# EAGLE design ESPF (EAGLE 9.6.2)
Assembly variants: Terminated, Inline
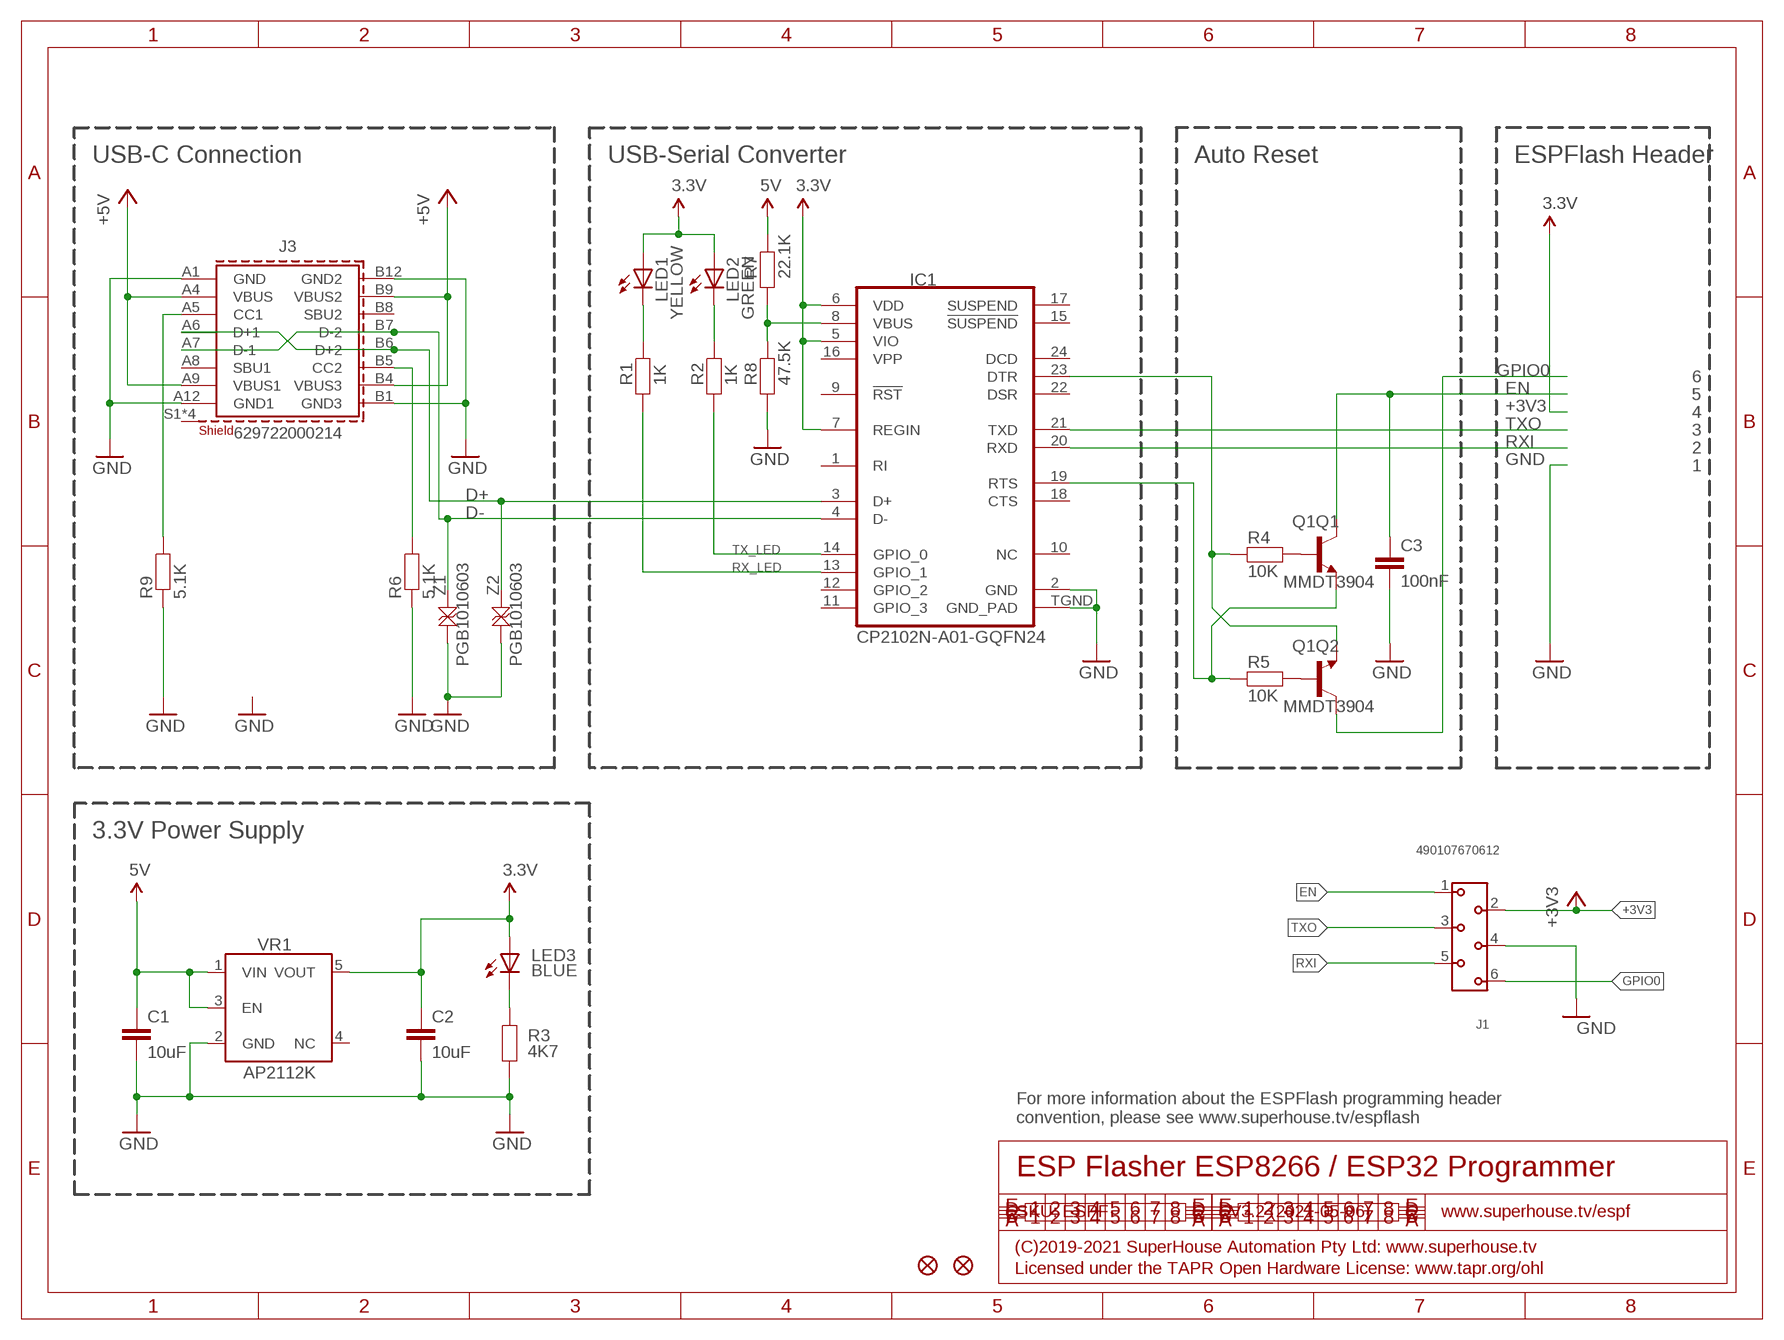
[diagram p0: schematic, sheet 1]

## Parts
C1  10uF  CAP0603  [C0603]
C2  10uF  CAP0603  [C0603]
C3  100nF  CAP0603  [C0603]
FID1  FIDUCIAL1X2.5  [FIDUCIAL-1X2.5]
FID2  FIDUCIAL1X2.5  [FIDUCIAL-1X2.5]
IC1  CP2102N-A01-GQFN24  CP2104  [QFN-24]
J1  490107670612  490107670612_DEBUGGING  [490107670612_DEBUGGING]  (not fitted in variant Terminated)  (not fitted in variant Inline)
J3  629722000214  [629722000214]
LED1  YELLOW  LED0603  [LED-0603]
LED2  GREEN  LED0603  [LED-0603]
LED3  BLUE  LED0603  [LED-0603]
Q1  MMDT3904  TRANS_NPN_DUAL-MMDT3904  [SOT-363]
R1  1K  RESISTOR0603  [R0603]
R2  1K  RESISTOR0603  [R0603]
R3  4K7  RESISTOR0603  [R0603]
R4  10K  RESISTOR0603  [R0603]
R5  10K  RESISTOR0603  [R0603]
R6  5.1K  RESISTOR0603  [R0603]
R7  22.1K  RESISTOR0603  [R0603]
R8  47.5K  RESISTOR0603  [R0603]
R9  5.1K  RESISTOR0603  [R0603]
VR1  AP2112K-3.3  AP2112KSOT25  [SOT23-5]
Z1  PGB1010603  TVS0603  [TVS0603]
Z2  PGB1010603  TVS0603  [TVS0603]

## Nets
+3V3 [Versorgung]: C2.1 IC1.5(VIO) IC1.6(VDD) IC1.7(REGIN) J1.2 LED1.A LED2.A LED3.A VR1.5(VOUT) ; supply symbol labelled 3.3V
+5V: C1.1 J3.A4(VBUS) J3.A9(VBUS1) J3.B4(VBUS3) J3.B9(VBUS2) R7.2 VR1.1(VIN) VR1.3(EN) ; supply symbol labelled 5V
D+: IC1.3(D+) J3.A6(D+1) J3.B6(D+2) Z2.2
D-: IC1.4(D-) J3.A7(D-1) J3.B7(D-2) Z1.2
DTR: IC1.23(DTR) Q1.1(Q2:E) R4.1
EN: C3.1 J1.1 Q1.3(Q1:C)
GND: C1.2 C2.2 C3.2 IC1.2(GND) IC1.TGND(GND_PAD) J1.4 J3.A1(GND) J3.A12(GND1) J3.B1(GND3) J3.B12(GND2) R3.1 R6.1 R8.1 R9.1 VR1.2(GND) Z1.1 Z2.1
GPIO0: J1.6 Q1.6(Q2:C)
N$3: LED1.C R1.2
N$4: LED2.C R2.2
N$5: LED3.C R3.2
N$6: IC1.8(VBUS) R7.1 R8.2
N$7: Q1.5(Q1:B) R4.2
N$8: Q1.2(Q2:B) R5.2
N$9: J3.B5(CC2) R6.2
N$10: J3.A5(CC1) R9.2
RTS: IC1.19(RTS) Q1.4(Q1:E) R5.1
RX_LED: IC1.13(GPIO_1) R1.1
RXI: IC1.20(RXD) J1.5
TX_LED: IC1.14(GPIO_0) R2.1
TXO: IC1.21(TXD) J1.3
Unconnected: IC1.1(RI) IC1.9(!RST) IC1.10(NC) IC1.11(GPIO_3) IC1.12(GPIO_2) IC1.15(!SUSPEND) IC1.16(VPP) IC1.17(SUSPEND) IC1.18(CTS) IC1.22(DSR) IC1.24(DCD) J3.A8(SBU1) J3.B8(SBU2) J3.S1(SHIELD) J3.S2(SHIELD) J3.S3(SHIELD) J3.S4(SHIELD) VR1.4(NC)

## Notes on the sheet
- USB-C Connection | USB-Serial Converter | Auto Reset | ESPFlash Header
- 6
- 5
- 4
- 3
- 2
- 1
- 3.3V Power Supply
- For more information about the ESPFlash programming header
  convention, please see www.superhouse.tv/espflash
- ESP Flasher ESP8266 / ESP32 Programmer
- SKU: ESPF | V3.2 (2021-05-06) | www.superhouse.tv/espf
- (C)2019-2021 SuperHouse Automation Pty Ltd: www.superhouse.tv
- Licensed under the TAPR Open Hardware License: www.tapr.org/ohl

## Library data of the parts
C1-C3 = SuperHouse-DiscreteSemi:CAP: Capacitor Standard ceramic capacitor
FID1 FID2 = SuperHouse-Symbols:FIDUCIAL: Fiducial Alignment Points Various fiducial points for machine vision alignment.
IC1 = SuperHouse-ICs:CP2104: CP2104 / CP2102N-A01-GQFN24 CP2104 USB to serial converter. The CP2104 is not recommended for new designs: replace with CP2102N-A01-GQFN24.
J1 = Wurth_Connectors_WR-WST:490107670612_DEBUGGING: WR-WST REDFIT IDC SKEDD Only use for debugging or programming application. For mechanical stressed application please use the PCB layout for permanent application PACKAGING PROPERTIES Packaging Tube ELECTRICAL PROPERTIES IR1 1 A RISO 1000 MΩ Withstanding Voltage 500 V (AC) Contact Resistance 10 mΩ PROPERTIES Insulator Material LCP Insulator Flammability Rating UL94 V-0 Insulator Color Black Contact Material CuNiSi Contact Plating Au (SKEDD), Sn (IDC) Pitch 2.54 mm Cable AWG 28/1.27 mm ribbon cable Operating Temperature -25 up to +105 °C Compliance Lead free / RoHS <https://katalog.we-online.com/media/images/v2/o104848v209%20Single_WR-WST_REDFIT.jpg> Details see: https://katalog.we-online.com/en/em/REDFIT_IDC_SKEDD Updated By Ella Wu 2019-05-21 2019 (C) Wurth Elektronik; CONTACT-RESISTANCE: 10mOhm; DATASHEET-URL: https://katalog.we-online.com/em/datasheet/490107670612.pdf; GENDER: Transition; IR: 1A; L: 15.21mm; PACKAGING: Tube; PART-NUMBER: 490107670612; PINS: 6; PITCH: 2.54mm; TOL-R: max.; USE-WITH: WR-CAB 1.27 mm Ribbon Flat Cable/WR-CAB 1.27 mm Ribbon Flat Cable 1 m pieces; WE-NUMBER: 490107670612; WORKING-VOLTAGE: 100V(AC)
J3 = Wurth_Connectors_WR-USB:629722000214: WR-COM USB 2.0 Type C Plug Vertical SMT Kind Properties Durability 10 000 Mating cycles Gender Receptacle Type Horizontal General Information Operating Temperature -40 up to +85 °C Electrical Properties Working Voltage 20 V (DC) Withstanding Voltage 100 V (AC) Contact Resistance 40 mΩ Material Properties Insulator Material LCP Insulator Flammability Rating UL94 V-0 Insulator Color Black Contact Material Brass Contact Plating Gold over Nickel Contact Type Stamped Shielding Material Steel Shielding Plating Nickel (Ni) <https://www.we-online.com/catalog/media/o689297v209%20family-wr-com-629722000214.jpg> Details see: www.we-online.com/catalog/WR-COM_USB_20_TYPE_C_RECEPTACLE_HORIZONTAL_SMT <www.we-online.com/catalog/WR-COM_USB_20_TYPE_C_RECEPTACLE_HORIZONTAL_SMT/?utm_source=eagle_model&utm_medium=description_link&utm_campaign=eisos_eagle> Updated by Ella Wu 2022-11-15 2022 (C) Würth Elektronik; APPLICATION: USB 2.0; DATASHEET-URL: https://www.we-online.com/redexpert/spec/629722000214?ae; GERDER: Receptacle; INTERFACE-TYPE: Type C; IR: 5A; MOUNT: SMT; PACKAGING: Tape and Reel; PART-NUMBER: 629722000214; PINS: 16; TYPE: Horizontal; WORKING-VOLTAGE: 20V(AC)
LED1-LED3 = SuperHouse-LEDs:LED: LEDs Standard schematic elements and footprints for 5mm, 3mm, 1206, and 0603 sized LEDs. 5mm - Spark Fun Electronics SKU : COM-00529 (and others)
Q1 = SuperHouse-DiscreteSemi:TRANS_NPN_DUAL: MMDT3904 Dual 3904 NPN transistors. Datasheet <http://www.onsemi.com/pub_link/Collateral/MBT3904DW1T1-D.PDF>; PROD_ID: TRANS-13337
R1-R9 = SuperHouse-DiscreteSemi:RESISTOR: Resistor Standard resistors.
VR1 = SuperHouse-Regulators:AP2112K: AP2112K LDO linear voltage regulator
Z1 Z2 = SuperHouse-DiscreteSemi:TVS: TVS voltage protection Zener

## Net classes
0 default: width 0.152 mm, drill 0.241 mm, clearance 0.152 mm
1 Versorgung: width 0.2 mm, drill 0.02 mm, clearance 0.032 mm

## Board
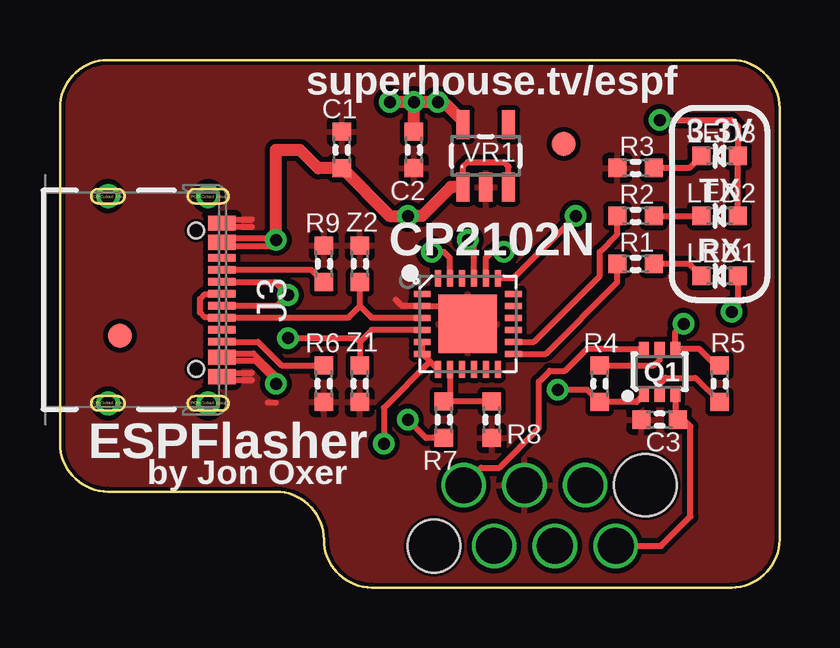
[diagram p1: board, top side]
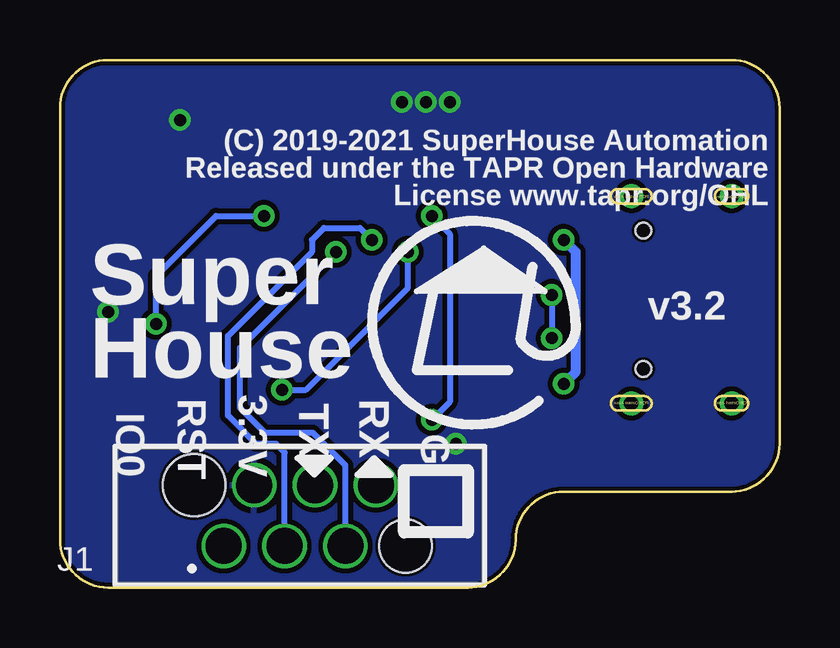
[diagram p2: board, bottom side, seen from below]

Size 30 x 22 mm. Coordinates in mm from the lower left corner, seen from the top.
Outline: 30,2 30,20 arc90 28,22 2,22 arc90 0,20 0,6 arc90 2,4 9,4 arc-90 11,2 arc90 13,0 28,0 arc90 30,2
Copper layers (1*16): Top 0.035mm / dielectric 1.5mm / Bottom 0.035mm
Design rules "SuperHouse-Design-Rules *": minimum track width 9mil, minimum drill 0.3mm, track to track 8mil, track to pad 8mil, pad to pad 7mil, via to via 8mil, smd to smd 6mil, copper to edge 6mil, drill to drill 8mil, minimum pad ring 7mil, minimum via ring 8mil, stop-mask expansion 4mil, vias tented up to drill 0.5mm, thermal gap 10mil

### Footprints (pad centres in the part's own frame; a part is rotated, then mirrored left to right if it is on the bottom)
C0603 = smd 0.762 x 0.762: 1 -0.762,0; 2 0.762,0
FIDUCIAL-1X2.5 = smd 1 x 1: 1 0,0
QFN-24 = smd 0.25 x 0.7: 1 -1.25,-1.9; 2 -0.75,-1.9; 3 -0.25,-1.9; 4 0.25,-1.9; 5 0.75,-1.9; 6 1.25,-1.9; 13 1.25,1.9; 14 0.75,1.9; 15 0.25,1.9; 16 -0.25,1.9; 17 -0.75,1.9; 18 -1.25,1.9 | smd 0.7 x 0.25: 7 1.9,-1.25; 8 1.9,-0.75; 9 1.9,-0.25; 10 1.9,0.25; 11 1.9,0.75; 12 1.9,1.25; 19 -1.9,1.25; 20 -1.9,0.75; 21 -1.9,0.25; 22 -1.9,-0.25; 23 -1.9,-0.75; 24 -1.9,-1.25 | smd 2.45 x 2.45: TGND 0,0
490107670612_DEBUGGING = drill 1.5 pad 1.825: 1 3.175,1.27; 2 1.905,-1.27; 3 0.635,1.27; 4 -0.635,-1.27; 5 -1.905,1.27; 6 -3.175,-1.27 | hole 2.2: -4.405,1.27 | hole 2.6: 4.405,-1.27
629722000214 = smd 0.3 x 1.15: A1 -3.35,4.745; A4 -2.55,4.745; A5 -1.25,4.745; A6 -0.25,4.745; A7 0.25,4.745; A8 1.25,4.745; A9 2.55,4.745; A12 3.35,4.745; B1 3.05,4.745; B4 2.25,4.745; B5 1.75,4.745; B6 0.75,4.745; B7 -0.75,4.745; B8 -1.75,4.745; B9 -2.25,4.745; B12 -3.05,4.745 | drill 0.6 pad 1: S1 -4.32,4.18; S2 4.32,4.18; S3 -4.32,0; S4 4.32,0 | hole 0.65: -2.89,3.68; 2.89,3.68
LED-0603 = smd 0.762 x 0.762: A -0.762,0; C 0.762,0
SOT-363 = smd 0.42 x 0.6: 1 -0.65,-0.95; 2 0,-0.95; 3 0.65,-0.95; 4 0.65,0.95; 5 0,0.95; 6 -0.65,0.95
R0603 = smd 0.762 x 0.762: 1 -0.762,0; 2 0.762,0
SOT23-5 = smd 0.55 x 1.2: 1 -0.95,-1.3; 2 0,-1.3; 3 0.95,-1.3; 4 0.95,1.3; 5 -0.95,1.3
TVS0603 = smd 0.762 x 0.762: 1 -0.762,0; 2 0.762,0

### Placement (x,y rotation side)
C1  11.75,18.25 90 top
C2  14.75,18.25 270 top
C3  25,7 180 top
FID1  2.5,10.5 0 top
FID2  21,18.5 0 top
IC1  17,11 270 top
J1  20,3 180 bottom
J3  2,12 270 top
LED1  27.5,13 180 top
LED2  27.5,15.5 180 top
LED3  27.5,18 180 top
Q1  25,9 0 top
R1  24,13.5 0 top
R2  24,15.5 0 top
R3  24,17.5 0 top
R4  22.5,8.5 90 top
R5  27.5,8.5 270 top
R6  11,8.5 90 top
R7  16,7 270 top
R8  18,7 90 top
R9  11,13.5 270 top
VR1  17.75,18 0 top
Z1  12.5,8.5 90 top
Z2  12.5,13.5 270 top

### Tracks (layer width: path | path; a pad name or v marks a point on that pad's centre or on a via)
+3V3  (via drill 0.5)
  Top 0.254: LED1.A 28.26,11.76 v28,11.5 | IC1.5 IC1.6 15.43,9.43 | 15.43,9.43 IC1.7 | LED2.A LED3.A 28.26,19.24 28,19.5 v25,19.5 | 15.43,9.43 13.5,7.5 v13.5,6
  Top 0.508: v14.75,20.25 v13.75,20.25 | v14.75,20.25 v15.75,20.25 16,20.25 16.8,19.45 VR1.5 | C2.1 v14.75,20.25
  pour Bottom: 0,20 arc-90 2,22 28,22 arc-90 30,20 30,2 arc-90 28,0 13,0 arc-90 11,2 arc90 9,4 2,4 arc-90 0,6
+5V  (via drill 0.5)
  Top 0.254: J3.B4 6.76,9.77 8.06,9.77 9,8.83 v9,8.5 9,8.6 8.15,9.45 J3.A9 | J3.A4 6.76,14.56 9,14.56 v9,14.5 9,14.25 J3.B9 | VR1.3 18.7,17.55 18.5,17.75 17,17.75 16.8,17.55 VR1.1 | R7.2 15.26,6.24 v14.5,7
  Top 0.508: VR1.1 16.3,16.7 15.1,15.5 v14.5,15.5 13.74,15.5 C1.1 10.76,17.49 10,18.25 9,18.25 v9,14.5
  Bottom 0.254: v14.5,15.5 13.75,14.75 13.75,7.75 v14.5,7
  Bottom 0.406: v9,8.5 8.5,9 8.5,14 v9,14.5
D+
  Top 0.254: 12.5,11.75 Z2.2 | IC1.3 13,11.25 12.5,11.75 | 12.5,11.75 12,11.25 J3.B6 6.72,11.27 6.03,11.27 5.84,11.46 5.84,12.04 6.03,12.23 6.72,12.23 J3.A6
D-  (via drill 0.5)
  Top 0.254: 12.5,10.25 Z1.2 | 12.5,10.25 12.35,10.4 v9.5,10.4 | IC1.4 13,10.75 12.5,10.25 | J3.B7 8.95,12.75 v9.5,12.2 9.15,11.85 9.05,11.75 J3.A7
  Bottom 0.254: v9.5,12.2 v9.5,10.4
DTR  (via drill 0.5)
  Top 0.254: Q1.1 24.04,7.74 R4.1 21.99,8.25 v20.75,8.25 | IC1.23 16.25,13.75 16,14 v15.5,14
  Bottom 0.254: v20.75,8.25 19.75,8.25 15.5,12.5 v15.5,14
EN
  Top 0.254: Q1.3 25.65,7.11 C3.1 26,7 26.29,6.71 26.29,2.96 25.06,1.73 J1.1
GND
  Top 0.254: 14,12 14.25,11.75 IC1.2 16,11.75 16.25,11.75 IC1.TGND | J3.B12 8,15.05 | J3.A1 8,15.35 | 8.68,7.72 9,7.72 | J3.A12 8,8.65 | J3.B1 8,8.95
  pour Top: 0,20 arc-90 2,22 28,22 arc-90 30,20 30,2 arc-90 28,0 13,0 arc-90 11,2 arc90 9,4 2,4 arc-90 0,6
GPIO0
  Top 0.254: J1.6 17.55,5 18.32,5 19.97,6.65 19.97,8.57 20.43,9.03 21.04,9.03 21.98,9.97 23.02,9.97 23.04,9.95 Q1.6
N$3
  Top 0.254: R1.2 26.24,13.5 LED1.C
N$4
  Top 0.254: R2.2 LED2.C
N$5
  Top 0.254: R3.2 26.24,17.5 LED3.C
N$6
  Top 0.254: R8.2 R7.1 16.25,8.01 IC1.8
N$7
  Top 0.254: R4.2 24.76,9.26 25,9.5 Q1.5
N$8
  Top 0.254: Q1.2 25,8.5 25.25,8.75 26.49,8.75 R5.2
N$9
  Top 0.254: R6.2 9.24,9.26 8.25,10.25 J3.B5
N$10
  Top 0.254: R9.2 10.87,12.87 10.49,13.25 J3.A5
RTS  (via drill 0.5)
  Top 0.254: R5.1 27.34,9.26 26.65,9.95 Q1.4 25.65,10.65 v26,11 | v21.5,15.5 18.9,12.9 IC1.19
  Bottom 0.254: v26,11 26,13 23.5,15.5 v21.5,15.5
RX_LED
  Top 0.254: IC1.13 20.25,9.75 23.24,12.74 R1.1
RXI  (via drill 0.5)
  Top 0.254: IC1.20 17.75,13.75 18,14 v18.5,14
  Bottom 0.254: v18.5,14 22.5,10 22.5,7.5 21.46,6.46 19.46,6.46 18.09,5.09 J1.5
TX_LED
  Top 0.254: IC1.14 19.75,10.25 22.5,13 22.5,14 23.24,14.74 R2.1
TXO  (via drill 0.5)
  Top 0.254: IC1.21 17.25,14.25 v17,14.5
  Bottom 0.254: v17,14.5 17.5,15 19,15 19.5,14.5 19.5,14 23,10.5 23,7.17 21.83,6 21,6 20.64,5.63 J1.3

### Text on the board
tPlace: superhouse.tv/espf | 3.3V | TX | CP2102N | RX | ESPFlasher | by Jon Oxer
bPlace: (C) 2019-2021 SuperHouse Automation / Released under the TAPR Open Hardware / License www.tapr.org/OHL | v3.2 | Super / House | G | RX | TX | 3.3V | IO0 | RST
tValues: K | A | K | A | K | A